# Altium schematic sheet EIS_Flow_Sensor.SchDoc: 2D-Flow Heizer & Sensor-Verstärker
size A4; FaxNumber: +49 7721 943 140; Organization: Hahn-Schickard; Address1: Wilhelm-Schickard-Str. 10; Address2: 78052 Villingen-Schwenningen; Address3: Bernd.Ehrbrecht@Hahn-Schickard.de; DocumentNumber: 1; Revision: 1.0; SheetNumber: 2; SheetTotal: 2; PhoneNumber: 0 7721 943 137; E-Mail: Xxxx.Xxxx@Hahn-Schickard.de; ProjectName: Project File Name
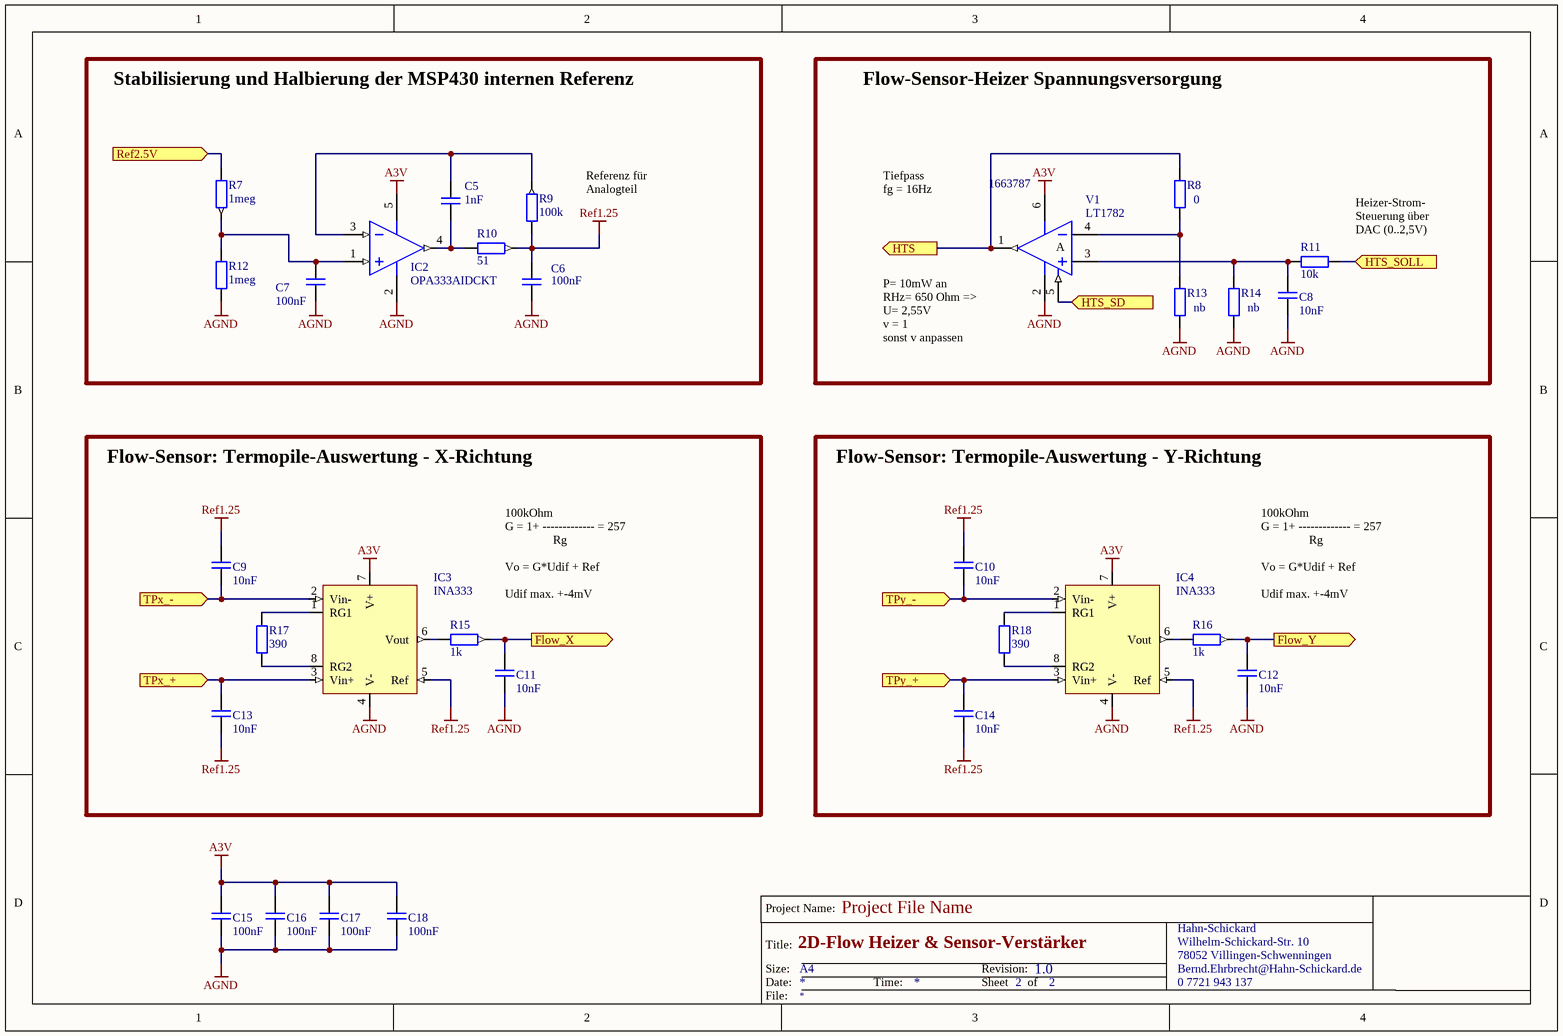
[diagram p0: EIS_Flow_Sensor.SchDoc]

## Parts
C5  1nF  [CAPC1608N]
C6  100nF  [CAPC1608N]
C7  100nF  [CAPC1608N]
C8  10nF  [CAPC1608N]
C9  10nF  [CAPC1608N]
C10  10nF  [CAPC1608N]
C11  10nF  [CAPC1608N]
C12  10nF  [CAPC1608N]
C13  10nF  [CAPC1608N]
C14  10nF  [CAPC1608N]
C15  100nF  [CAPC1608N]
C16  100nF  [CAPC1608N]
C17  100nF  [CAPC1608N]
C18  100nF  [CAPC1608N]
IC2  OPA333AIDCKT  [TI-DCK5_V]
IC3  INA333  [TI-DRG8-2400X1450TP_V]
IC4  INA333  [TI-DRG8-2400X1450TP_V]
R7  1meg  [RESC1608N]
R8  0  [RESC1608N]
R9  100k  [RESC1608N]
R10  51  [RESC1608N]
R11  10k  [RESC1608N]
R12  1meg  [RESC1608N]
R13  nb  [RESC1608N]
R14  nb  [RESC1608N]
R15  1k  [RESC1608N]
R16  1k  [RESC1608N]
R17  390  [RESC1608N]
R18  390  [RESC1608N]
V1  LT1782  Supplier Part Number 1: 1663787  [SOT23-6]

## Ports
Flow_X (out), Flow_Y (out), HTS (out), HTS_SD (in), HTS_SOLL (in), Ref2.5V (in), TPx_+ (in), TPx_- (in), TPy_+ (in), TPy_- (in)

## Nets
A3V: C15.1 C16.1 C17.1 C18.2 IC2.5(V+) IC3.7(V+) IC4.7(V+) V1.6(V+)
AGND: C6.2 C7.2 C8.1 C11.1 C12.1 C15.2 C16.2 C17.2 C18.1 IC2.2(V-) IC3.4(V-) IC4.4(V-) R12.2 R13.1 R14.1 V1.2(V-)
Ref1.25: C6.1 C9.1 C10.1 C13.2 C14.2 IC3.5(Ref) IC4.5(Ref) R9.2 R10.1
Flow_X: C11.2 R15.1 ; port Flow_X
Flow_Y: C12.2 R16.1 ; port Flow_Y
HTS: R8.2 V1.1(OUT) ; port HTS
HTS_SD: V1.5(Shdn) ; port HTS_SD
HTS_SOLL: R11.1 ; port HTS_SOLL
Ref2.5V: R7.1 ; port Ref2.5V
TPx_+: C13.1 IC3.3(Vin+) ; port TPx_+
TPx_-: C9.2 IC3.2(Vin-) ; port TPx_-
TPy_+: C14.1 IC4.3(Vin+) ; port TPy_+
TPy_-: C10.2 IC4.2(Vin-) ; port TPy_-
NetC5_1: C5.1 IC2.3(IN-) R9.1
NetC5_2: C5.2 IC2.4(OUT) R10.2
NetC7_1: C7.1 IC2.1(IN+) R7.2 R12.1
NetC8_2: C8.2 R11.2 R14.2 V1.3(IN+)
NetIC3_1: IC3.1(RG1) R17.2
NetIC3_6: IC3.6(Vout) R15.2
NetIC3_8: IC3.8(RG2) R17.1
NetIC4_1: IC4.1(RG1) R18.2
NetIC4_6: IC4.6(Vout) R16.2
NetIC4_8: IC4.8(RG2) R18.1
NetR8_1: R8.1 R13.2 V1.4(IN-)

## Notes on the sheet
- Stabilisierung und Halbierung der MSP430 internen Referenz
- Flow-Sensor-Heizer Spannungsversorgung
- Referenz für
  Analogteil
- Tiefpass
  fg = 16Hz
- (near R11) Heizer-Strom-
  Steuerung über DAC (0..2,5V)
- (near V1) P= 10mW an
  RHz= 650 Ohm =>
  U= 2,55V
  v = 1
  sonst v anpassen
- Flow-Sensor: Termopile-Auswertung - X-Richtung
- Flow-Sensor: Termopile-Auswertung - Y-Richtung
- 100kOhm
  G = 1+ ------------- = 257
  Rg
  Vo = G*Udif + Ref
  Udif max. +-4mV
- Project Name:
- Size:
- Date:
- Title:
- A4
- Time:
- Revision:
- Sheet
- of
- File:
- (in symbol LT1782_SD) A

## Library data of the parts
C5-C18 = Kondensator SMD Keramik
IC2 = OPA333AIDCKT: 17 uA, MicroPower, Precision, Zero Drift CMOS Operational Amplifier, 1.8 to 5.5 V, -40 to 125 degC, 5-pin SOT23 (DCK5), Green (RoHS & no Sb/Br); Manufacturer: Texas Instruments; CMRR(Min)(dB): 106; IIB(Max)(pA): 200; Iq per channel(Max)(mA): 0.025; Number of Channels: 1; Offset Drift(Typ)(uV/C): 0.02; Slew Rate(Typ)(V/us): 0.16; Sub Family: Low Offset Voltage Amplifier (<=500uV), Low Power Amp (<=500uA), Low Supply Voltage Amplifier (<=2.7V), Precision Amplifier, Zero Drift Precision Amplifier; Total Supply Voltage(Max)(+5V is 5, +/-5V is 10): 5.5; Total Supply Voltage(Min)(+5V is 5, +/-5V is 10): 1.8; Vio (25C)(Max)(mV): 0.01; DatasheetVersion: SBOS351C; PackageVersion: 4093553-3/G, 01/2007; PackageReference: DCK5; PackageDescription: 5-Pin Plastic Small Outline, Body 2 x 1.25 mm, Pitch 0.65 mm; Supplier 1: Digi-Key; Supplier Part Number 1: 296-26270-2-ND; Supplier 2: Digi-Key; Supplier Part Number 2: 296-26270-1-ND; Supplier 3: Digi-Key; Supplier Part Number 3: 296-26270-6-ND; Supplier 4: Farnell; Supplier Part Number 4: 1273122; Supplier 5: Newark; Supplier Part Number 5: 80K2661; Supplier 6: Mouser; Supplier Part Number 6: 595-OPA333AIDCKT; Eco-Plan: Green (RoHS & no Sb/Br); Mounting Technology: Surface Mount; Code_JEDEC: MO-203; PartNumber: OPA333AIDCKT; ComponentLink1Description: Manufacturer URL; ComponentLink1URL: http://www.ti.com/; ComponentLink2Description: Datasheet; ComponentLink2URL: http://www.ti.com/general/docs/lit/getliterature.tsp?genericPartNumber=OPA333&fileType=pdf; ComponentLink3Description: Package Specification; ComponentLink3URL: http://www.ti.com/litv/pdf/mpds025f
IC3 IC4 = INA333: Instrumentation Amplifier; Package Document: O:\Altium Designer\Datasheets\Texas Instruments\INA333; Suplier: Seller; Suplier Ordering Number: Ordering Number; ComponentLink1Description: Texas Instruments; ComponentLink1URL: http://www.ti.com; ComponentLink2Description: Datasheet; ComponentLink2URL: http://www.ti.com; DatasheetDokument: O:\Altium Designer\Datasheets\Texas Instruments\INA333; Published: 12.10.2010; Publisher: HSG Jürgen Merz
R7-R18 = Widerstand SMD
V1 = LT1782_SD: Supplier 1: Farnell